# Altium project EIT.PrjPcb
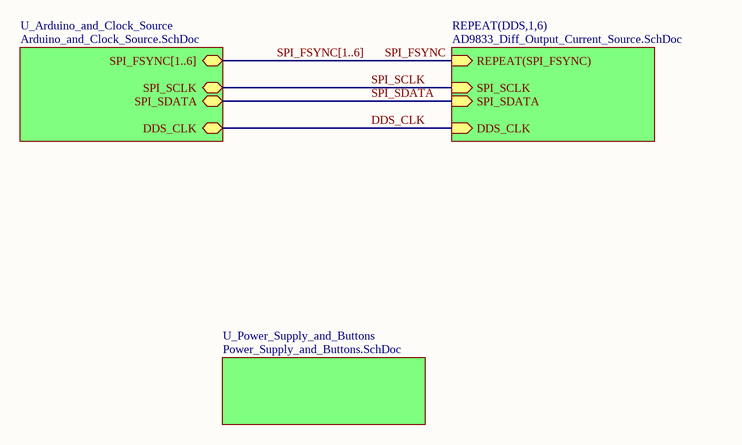
[diagram p0: Parallel_CS_Top.SchDoc]
4 sheets, 393 parts. Net scope: hierarchical (ports join the sheet entries above them; power ports are global).
Board file: Parallel_CS.PcbDoc
Sheets:
  Parallel_CS_Top.SchDoc
    DDS1 = AD9833_Diff_Output_Current_Source.SchDoc
    DDS2 = AD9833_Diff_Output_Current_Source.SchDoc
    DDS3 = AD9833_Diff_Output_Current_Source.SchDoc
    DDS4 = AD9833_Diff_Output_Current_Source.SchDoc
    DDS5 = AD9833_Diff_Output_Current_Source.SchDoc
    DDS6 = AD9833_Diff_Output_Current_Source.SchDoc
    U_Power_Supply_and_Buttons = Power_Supply_and_Buttons.SchDoc
    U_Arduino_and_Clock_Source = Arduino_and_Clock_Source.SchDoc

## Sheet Parallel_CS_Top.SchDoc
size A4

### Sub-sheets
REPEAT(DDS,1,6) = AD9833_Diff_Output_Current_Source.SchDoc: REPEAT(SPI_FSYNC) (in), SPI_SCLK (in), SPI_SDATA (in), DDS_CLK (in)
U_Arduino_and_Clock_Source = Arduino_and_Clock_Source.SchDoc: DDS_CLK (bidir), SPI_SDATA (bidir), SPI_SCLK (bidir), SPI_FSYNC[1..6] (bidir)
U_Power_Supply_and_Buttons = Power_Supply_and_Buttons.SchDoc: no entries

### Nets
DDS_CLK: sheet REPEAT(DDS,1,6)/DDS_CLK, sheet U_Arduino_and_Clock_Source/DDS_CLK
SPI_FSYNC: sheet REPEAT(DDS,1,6)/REPEAT(SPI_FSYNC)
SPI_SCLK: sheet REPEAT(DDS,1,6)/SPI_SCLK, sheet U_Arduino_and_Clock_Source/SPI_SCLK
SPI_SDATA: sheet REPEAT(DDS,1,6)/SPI_SDATA, sheet U_Arduino_and_Clock_Source/SPI_SDATA

### Buses and harness runs
bus SPI_FSYNC[1..6] = sheet U_Arduino_and_Clock_Source/SPI_FSYNC[1..6]

## Sheet AD9833_Diff_Output_Current_Source.SchDoc
size A3
Used 6 times, as channels DDS1, DDS2, DDS3, DDS4, DDS5, DDS6. Parts and nets are listed once, with the designators drawn on the sheet.
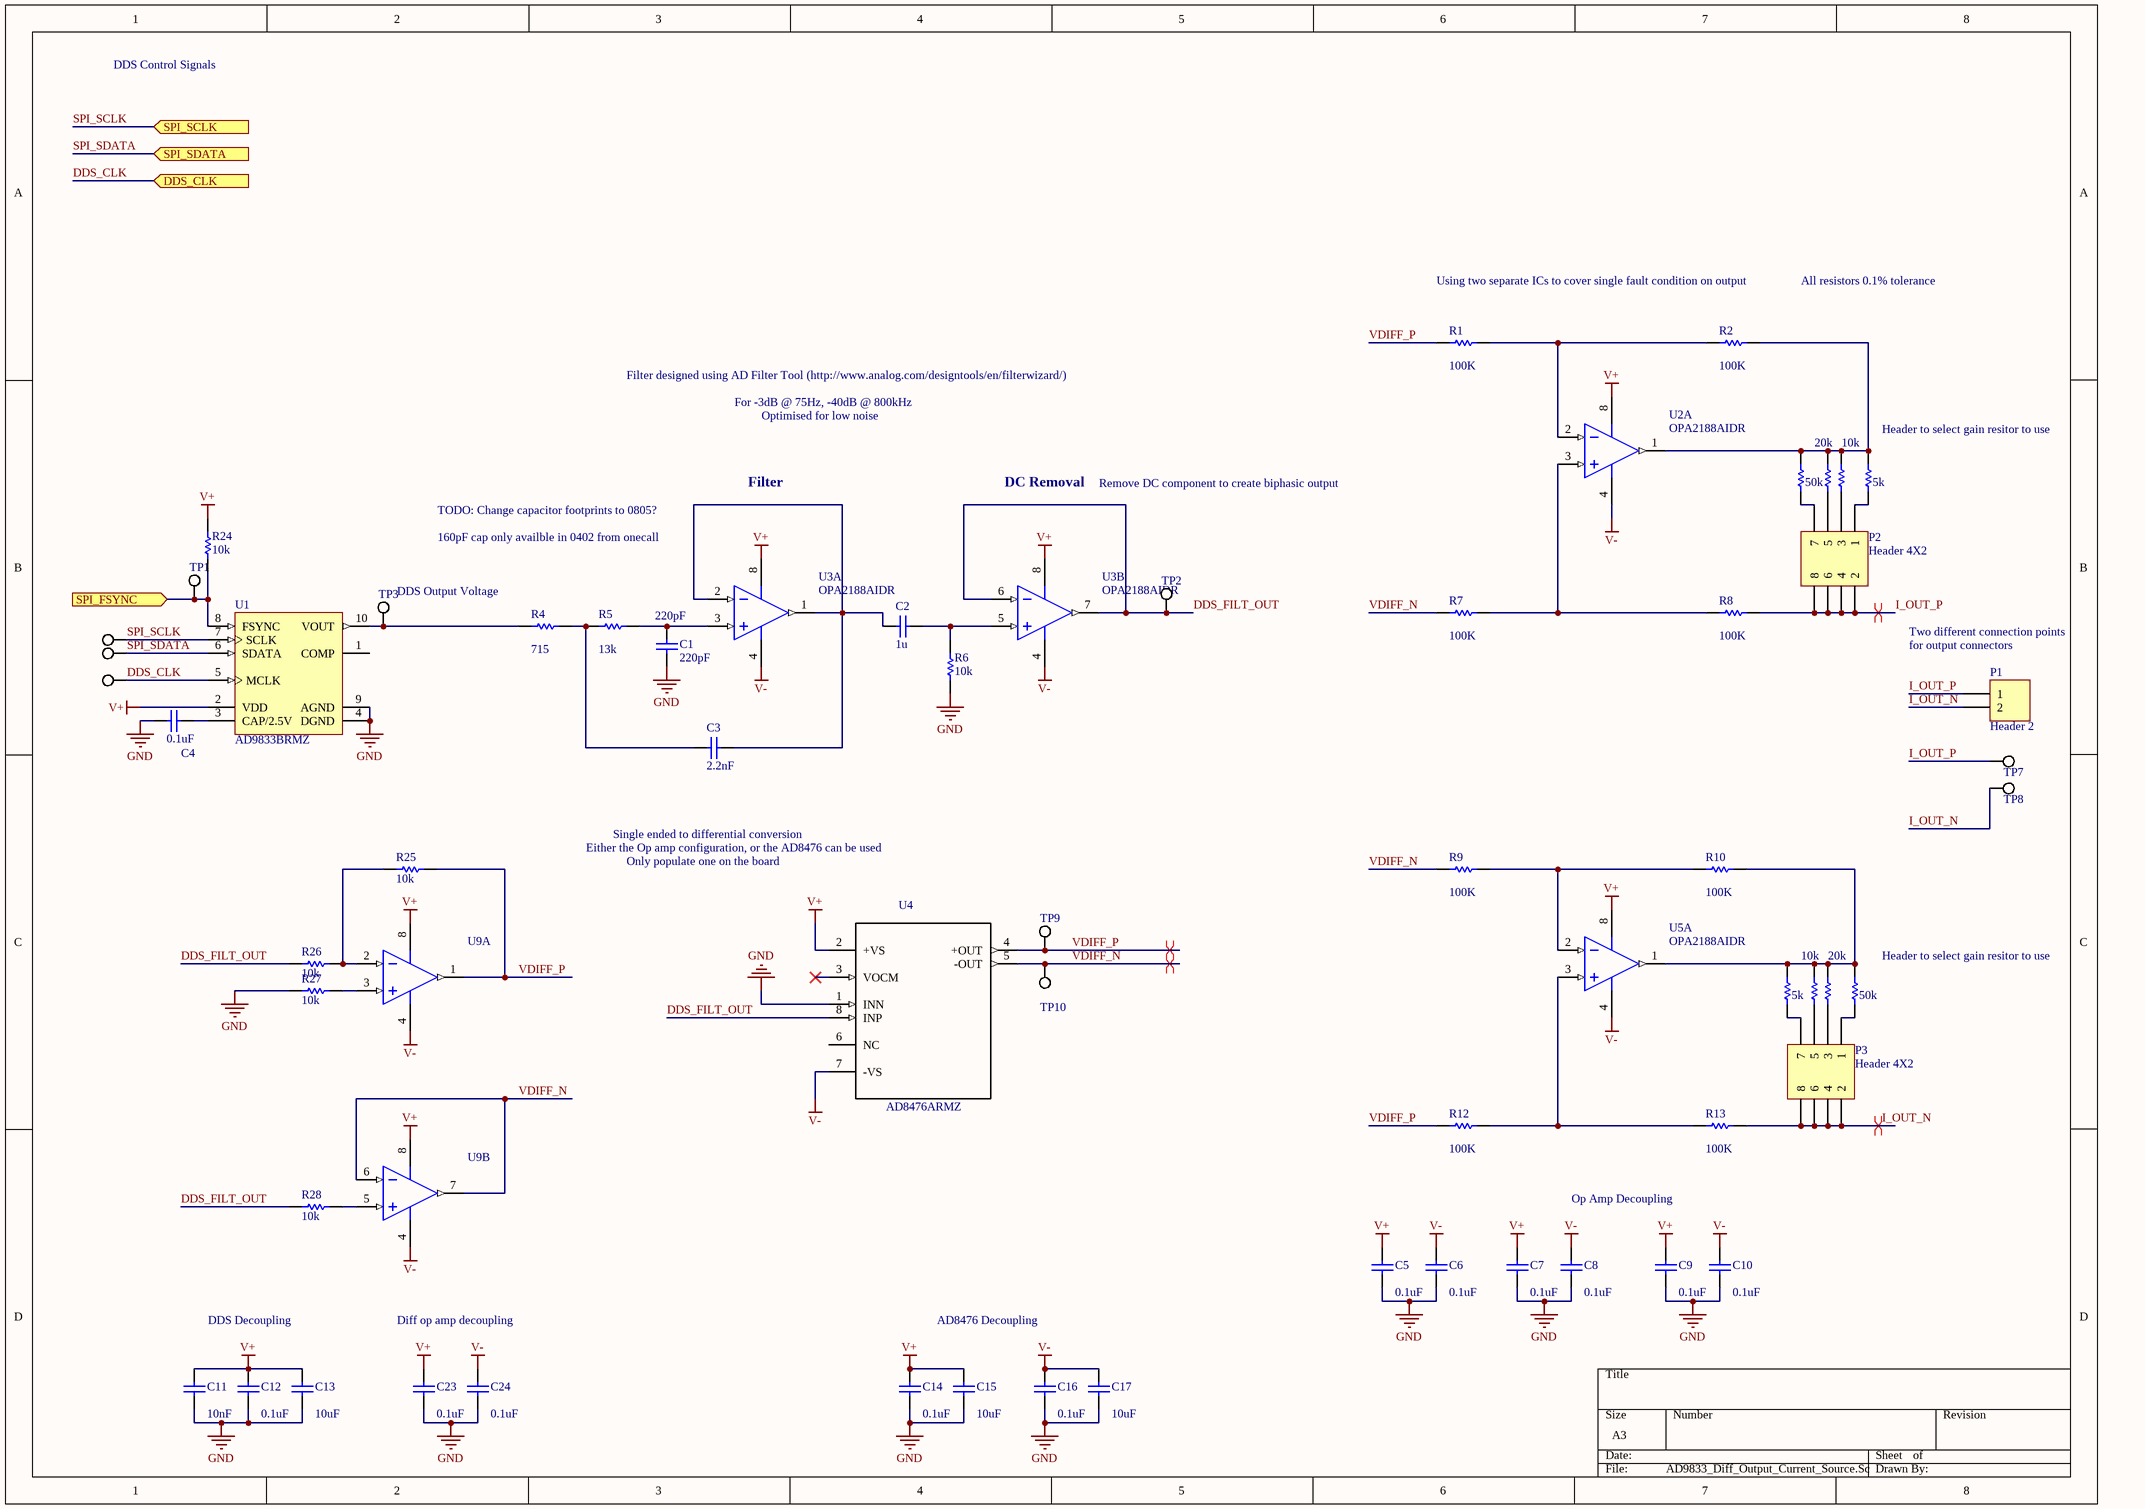
[diagram p1: AD9833_Diff_Output_Current_Source.SchDoc]

### Parts
C1  220pF  [1608[0603]]
C2  1u  [1608[0603]]
C3  2.2nF  [1608[0603]]
C4  0.1uF  [1608[0603]]
C5  0.1uF  [1608[0603]]
C6  0.1uF  [1608[0603]]
C7  0.1uF  [1608[0603]]
C8  0.1uF  [1608[0603]]
C9  0.1uF  [1608[0603]]
C10  0.1uF  [1608[0603]]
C11  10nF  [1608[0603]]
C12  0.1uF  [1608[0603]]
C13  10uF  [1608[0603]]
C14  0.1uF  [1608[0603]]
C15  10uF  [1608[0603]]
C16  0.1uF  [1608[0603]]
C17  10uF  [1608[0603]]
C23  0.1uF  [1608[0603]]
C24  0.1uF  [1608[0603]]
P1  Header 2  [HDR1X2]
P2  Header 4X2  [HDR2X4]
P3  Header 4X2  [HDR2X4]
R1  100K  [6-0805_M]
R2  100K  [6-0805_M]
R3  50k  [6-0805_M]
R4  715  [6-0805_M]
R5  13k  [6-0805_M]
R6  10k  [6-0805_M]
R7  100K  [6-0805_M]
R8  100K  [6-0805_M]
R9  100K  [6-0805_M]
R10  100K  [6-0805_M]
R11  20k  [6-0805_M]
R12  100K  [6-0805_M]
R13  100K  [6-0805_M]
R18  10k  [6-0805_M]
R19  5k  [6-0805_M]
R20  5k  [6-0805_M]
R21  10k  [6-0805_M]
R22  20k  [6-0805_M]
R23  50k  [6-0805_M]
R24  10k  [6-0805_M]
R25  10k  [6-0805_M]
R26  10k  [6-0805_M]
R27  10k  [6-0805_M]
R28  10k  [6-0805_M]
TP1  TESTPOINT_WHITE  [TestPointVia]  (value not drawn)
TP2  TESTPOINT_WHITE  [TestPointVia]  (value not drawn)
TP3  TESTPOINT_WHITE  [TestPointVia]  (value not drawn)
TP4  TESTPOINT_WHITE  [TestPointVia]  (value not drawn)
TP5  TESTPOINT_WHITE  [TestPointVia]  (value not drawn)
TP6  TESTPOINT_WHITE  [TestPointVia]  (value not drawn)
TP7  TESTPOINT_WHITE  [TestPointVia]  (value not drawn)
TP8  TESTPOINT_WHITE  [TestPointVia]  (value not drawn)
TP9  TESTPOINT_WHITE  [TestPointVia]  (value not drawn)
TP10  TESTPOINT_WHITE  [TestPointVia]  (value not drawn)
U1  AD9833BRMZ  [ADI-RM-10_M]
U2  OPA2188AIDR  [D0008A_L]  (part A of 2)
U3  OPA2188AIDR  [D0008A_L]  (parts A,B of 2)
U4  AD8476ARMZ  [SOP65P490X110-8N]
U5  OPA2188AIDR  [D0008A_L]  (part A of 2)
U9  OPA2188AIDR  [D0008A_L]  (value not drawn)  (parts A,B of 2)

### Ports
DDS_CLK (in), SPI_FSYNC (in), SPI_SCLK (in), SPI_SDATA (in)

### Nets
GND: C1.1 C4.1 C5.1 C6.1 C7.1 C8.1 C9.1 C10.1 C11.1 C12.1 C13.1 C14.1 C15.1 C16.1 C17.1 C23.1 C24.1 R6.1 R27.2 U1.4(DGND) U1.9(AGND) U4.1(INN)
V+: C5.2 C7.2 C9.2 C11.2 C12.2 C13.2 C14.2 C15.2 C23.2 R24.2 U1.2(VDD) U2.8(V+) U3.8(V+) U4.2(+VS) U5.8(V+) U9.8(V+)
V-: C6.2 C8.2 C10.2 C16.2 C17.2 C24.2 U2.4(V-) U3.4(V-) U4.7(-VS) U5.4(V-) U9.4(V-)
DDS_CLK: TP6.1 U1.5(MCLK) ; port DDS_CLK
DDS_FILT_OUT: R26.2 R28.2 TP2.1 U3.6(IN_B-) U3.7(OUT_B) U4.8(INP)
I_OUT_N: P1.2 P3.2 P3.4 P3.6 P3.8 R13.2 TP8.1
I_OUT_P: P1.1 P2.2 P2.4 P2.6 P2.8 R8.2 TP7.1
SPI_FSYNC: R24.1 TP1.1 U1.8(FSYNC) ; port SPI_FSYNC
SPI_SCLK: TP4.1 U1.7(SCLK) ; port SPI_SCLK
SPI_SDATA: TP5.1 U1.6(SDATA) ; port SPI_SDATA
VDIFF_N: R7.1 R9.1 TP10.1 U4.5(-OUT) U9.6(IN_B-) U9.7(OUT_B)
VDIFF_P: R1.1 R12.1 R25.1 TP9.1 U4.4(+OUT) U9.1(OUT_A)
NetC1_2: C1.2 R5.2 U3.3(IN_A+)
NetC2_1: C2.1 C3.1 U3.1(OUT_A) U3.2(IN_A-)
NetC2_2: C2.2 R6.2 U3.5(IN_B+)
NetC3_2: C3.2 R4.2 R5.1
NetC4_2: C4.2 U1.3(CAP/2.5V)
NetP2_1: P2.1 R19.2
NetP2_3: P2.3 R18.2
NetP2_5: P2.5 R11.2
NetP2_7: P2.7 R3.1
NetP3_1: P3.1 R23.1
NetP3_3: P3.3 R22.2
NetP3_5: P3.5 R21.2
NetP3_7: P3.7 R20.2
NetR1_2: R1.2 R2.1 U2.2(IN_A-)
NetR2_2: R2.2 R3.2 R11.1 R18.1 R19.1 U2.1(OUT_A)
NetR4_1: R4.1 TP3.1 U1.10(VOUT)
NetR7_2: R7.2 R8.1 U2.3(IN_A+)
NetR9_2: R9.2 R10.1 U5.2(IN_A-)
NetR10_2: R10.2 R20.1 R21.1 R22.1 R23.2 U5.1(OUT_A)
NetR12_2: R12.2 R13.1 U5.3(IN_A+)
NetR25_2: R25.2 R26.1 U9.2(IN_A-)
NetR27_1: R27.1 U9.3(IN_A+)
NetR28_1: R28.1 U9.5(IN_B+)

Not connected (* = marked no-connect by the designer): U1 1(COMP); U4 3(VOCM)* 6(NC)

### Channels
DDS1: designators C1=DDS1_C1 C2=DDS1_C2 C3=DDS1_C3 C4=DDS1_C4 C5=DDS1_C5 C6=DDS1_C6 C7=DDS1_C7 C8=DDS1_C8 C9=DDS1_C9 C10=DDS1_C10 C11=DDS1_C11 C12=DDS1_C12 C13=DDS1_C13 C14=DDS1_C14 C15=DDS1_C15 C16=DDS1_C16 C17=DDS1_C17 C23=DDS1_C23 C24=DDS1_C24 P1=DDS1_P1 P2=DDS1_P2 P3=DDS1_P3 R1=DDS1_R1 R2=DDS1_R2 R3=DDS1_R3 R4=DDS1_R4 R5=DDS1_R5 R6=DDS1_R6 R7=DDS1_R7 R8=DDS1_R8 R9=DDS1_R9 R10=DDS1_R10 R11=DDS1_R11 R12=DDS1_R12 R13=DDS1_R13 R18=DDS1_R18 R19=DDS1_R19 R20=DDS1_R20 R21=DDS1_R21 R22=DDS1_R22 R23=DDS1_R23 R24=DDS1_R24 R25=DDS1_R25 R26=DDS1_R26 R27=DDS1_R27 R28=DDS1_R28 TP1=DDS1_TP1 TP2=DDS1_TP2 TP3=DDS1_TP3 TP4=DDS1_TP4 TP5=DDS1_TP5 TP6=DDS1_TP6 TP7=DDS1_TP7 TP8=DDS1_TP8 TP9=DDS1_TP9 TP10=DDS1_TP10 U1=DDS1_U1 U2=DDS1_U2 U3=DDS1_U3 U4=DDS1_U4 U5=DDS1_U5 U9=DDS1_U9; ports DDS_CLK=DDS_CLK SPI_FSYNC=SPI_FSYNC1 SPI_SCLK=SPI_SCLK SPI_SDATA=SPI_SDATA
DDS2: designators C1=DDS2_C1 C2=DDS2_C2 C3=DDS2_C3 C4=DDS2_C4 C5=DDS2_C5 C6=DDS2_C6 C7=DDS2_C7 C8=DDS2_C8 C9=DDS2_C9 C10=DDS2_C10 C11=DDS2_C11 C12=DDS2_C12 C13=DDS2_C13 C14=DDS2_C14 C15=DDS2_C15 C16=DDS2_C16 C17=DDS2_C17 C23=DDS2_C23 C24=DDS2_C24 P1=DDS2_P1 P2=DDS2_P2 P3=DDS2_P3 R1=DDS2_R1 R2=DDS2_R2 R3=DDS2_R3 R4=DDS2_R4 R5=DDS2_R5 R6=DDS2_R6 R7=DDS2_R7 R8=DDS2_R8 R9=DDS2_R9 R10=DDS2_R10 R11=DDS2_R11 R12=DDS2_R12 R13=DDS2_R13 R18=DDS2_R18 R19=DDS2_R19 R20=DDS2_R20 R21=DDS2_R21 R22=DDS2_R22 R23=DDS2_R23 R24=DDS2_R24 R25=DDS2_R25 R26=DDS2_R26 R27=DDS2_R27 R28=DDS2_R28 TP1=DDS2_TP1 TP2=DDS2_TP2 TP3=DDS2_TP3 TP4=DDS2_TP4 TP5=DDS2_TP5 TP6=DDS2_TP6 TP7=DDS2_TP7 TP8=DDS2_TP8 TP9=DDS2_TP9 TP10=DDS2_TP10 U1=DDS2_U1 U2=DDS2_U2 U3=DDS2_U3 U4=DDS2_U4 U5=DDS2_U5 U9=DDS2_U9; ports DDS_CLK=DDS_CLK SPI_FSYNC=SPI_FSYNC2 SPI_SCLK=SPI_SCLK SPI_SDATA=SPI_SDATA
DDS3: designators C1=DDS3_C1 C2=DDS3_C2 C3=DDS3_C3 C4=DDS3_C4 C5=DDS3_C5 C6=DDS3_C6 C7=DDS3_C7 C8=DDS3_C8 C9=DDS3_C9 C10=DDS3_C10 C11=DDS3_C11 C12=DDS3_C12 C13=DDS3_C13 C14=DDS3_C14 C15=DDS3_C15 C16=DDS3_C16 C17=DDS3_C17 C23=DDS3_C23 C24=DDS3_C24 P1=DDS3_P1 P2=DDS3_P2 P3=DDS3_P3 R1=DDS3_R1 R2=DDS3_R2 R3=DDS3_R3 R4=DDS3_R4 R5=DDS3_R5 R6=DDS3_R6 R7=DDS3_R7 R8=DDS3_R8 R9=DDS3_R9 R10=DDS3_R10 R11=DDS3_R11 R12=DDS3_R12 R13=DDS3_R13 R18=DDS3_R18 R19=DDS3_R19 R20=DDS3_R20 R21=DDS3_R21 R22=DDS3_R22 R23=DDS3_R23 R24=DDS3_R24 R25=DDS3_R25 R26=DDS3_R26 R27=DDS3_R27 R28=DDS3_R28 TP1=DDS3_TP1 TP2=DDS3_TP2 TP3=DDS3_TP3 TP4=DDS3_TP4 TP5=DDS3_TP5 TP6=DDS3_TP6 TP7=DDS3_TP7 TP8=DDS3_TP8 TP9=DDS3_TP9 TP10=DDS3_TP10 U1=DDS3_U1 U2=DDS3_U2 U3=DDS3_U3 U4=DDS3_U4 U5=DDS3_U5 U9=DDS3_U9; ports DDS_CLK=DDS_CLK SPI_FSYNC=SPI_FSYNC3 SPI_SCLK=SPI_SCLK SPI_SDATA=SPI_SDATA
DDS4: designators C1=DDS4_C1 C2=DDS4_C2 C3=DDS4_C3 C4=DDS4_C4 C5=DDS4_C5 C6=DDS4_C6 C7=DDS4_C7 C8=DDS4_C8 C9=DDS4_C9 C10=DDS4_C10 C11=DDS4_C11 C12=DDS4_C12 C13=DDS4_C13 C14=DDS4_C14 C15=DDS4_C15 C16=DDS4_C16 C17=DDS4_C17 C23=DDS4_C23 C24=DDS4_C24 P1=DDS4_P1 P2=DDS4_P2 P3=DDS4_P3 R1=DDS4_R1 R2=DDS4_R2 R3=DDS4_R3 R4=DDS4_R4 R5=DDS4_R5 R6=DDS4_R6 R7=DDS4_R7 R8=DDS4_R8 R9=DDS4_R9 R10=DDS4_R10 R11=DDS4_R11 R12=DDS4_R12 R13=DDS4_R13 R18=DDS4_R18 R19=DDS4_R19 R20=DDS4_R20 R21=DDS4_R21 R22=DDS4_R22 R23=DDS4_R23 R24=DDS4_R24 R25=DDS4_R25 R26=DDS4_R26 R27=DDS4_R27 R28=DDS4_R28 TP1=DDS4_TP1 TP2=DDS4_TP2 TP3=DDS4_TP3 TP4=DDS4_TP4 TP5=DDS4_TP5 TP6=DDS4_TP6 TP7=DDS4_TP7 TP8=DDS4_TP8 TP9=DDS4_TP9 TP10=DDS4_TP10 U1=DDS4_U1 U2=DDS4_U2 U3=DDS4_U3 U4=DDS4_U4 U5=DDS4_U5 U9=DDS4_U9; ports DDS_CLK=DDS_CLK SPI_FSYNC=SPI_FSYNC4 SPI_SCLK=SPI_SCLK SPI_SDATA=SPI_SDATA
DDS5: designators C1=DDS5_C1 C2=DDS5_C2 C3=DDS5_C3 C4=DDS5_C4 C5=DDS5_C5 C6=DDS5_C6 C7=DDS5_C7 C8=DDS5_C8 C9=DDS5_C9 C10=DDS5_C10 C11=DDS5_C11 C12=DDS5_C12 C13=DDS5_C13 C14=DDS5_C14 C15=DDS5_C15 C16=DDS5_C16 C17=DDS5_C17 C23=DDS5_C23 C24=DDS5_C24 P1=DDS5_P1 P2=DDS5_P2 P3=DDS5_P3 R1=DDS5_R1 R2=DDS5_R2 R3=DDS5_R3 R4=DDS5_R4 R5=DDS5_R5 R6=DDS5_R6 R7=DDS5_R7 R8=DDS5_R8 R9=DDS5_R9 R10=DDS5_R10 R11=DDS5_R11 R12=DDS5_R12 R13=DDS5_R13 R18=DDS5_R18 R19=DDS5_R19 R20=DDS5_R20 R21=DDS5_R21 R22=DDS5_R22 R23=DDS5_R23 R24=DDS5_R24 R25=DDS5_R25 R26=DDS5_R26 R27=DDS5_R27 R28=DDS5_R28 TP1=DDS5_TP1 TP2=DDS5_TP2 TP3=DDS5_TP3 TP4=DDS5_TP4 TP5=DDS5_TP5 TP6=DDS5_TP6 TP7=DDS5_TP7 TP8=DDS5_TP8 TP9=DDS5_TP9 TP10=DDS5_TP10 U1=DDS5_U1 U2=DDS5_U2 U3=DDS5_U3 U4=DDS5_U4 U5=DDS5_U5 U9=DDS5_U9; ports DDS_CLK=DDS_CLK SPI_FSYNC=SPI_FSYNC5 SPI_SCLK=SPI_SCLK SPI_SDATA=SPI_SDATA
DDS6: designators C1=DDS6_C1 C2=DDS6_C2 C3=DDS6_C3 C4=DDS6_C4 C5=DDS6_C5 C6=DDS6_C6 C7=DDS6_C7 C8=DDS6_C8 C9=DDS6_C9 C10=DDS6_C10 C11=DDS6_C11 C12=DDS6_C12 C13=DDS6_C13 C14=DDS6_C14 C15=DDS6_C15 C16=DDS6_C16 C17=DDS6_C17 C23=DDS6_C23 C24=DDS6_C24 P1=DDS6_P1 P2=DDS6_P2 P3=DDS6_P3 R1=DDS6_R1 R2=DDS6_R2 R3=DDS6_R3 R4=DDS6_R4 R5=DDS6_R5 R6=DDS6_R6 R7=DDS6_R7 R8=DDS6_R8 R9=DDS6_R9 R10=DDS6_R10 R11=DDS6_R11 R12=DDS6_R12 R13=DDS6_R13 R18=DDS6_R18 R19=DDS6_R19 R20=DDS6_R20 R21=DDS6_R21 R22=DDS6_R22 R23=DDS6_R23 R24=DDS6_R24 R25=DDS6_R25 R26=DDS6_R26 R27=DDS6_R27 R28=DDS6_R28 TP1=DDS6_TP1 TP2=DDS6_TP2 TP3=DDS6_TP3 TP4=DDS6_TP4 TP5=DDS6_TP5 TP6=DDS6_TP6 TP7=DDS6_TP7 TP8=DDS6_TP8 TP9=DDS6_TP9 TP10=DDS6_TP10 U1=DDS6_U1 U2=DDS6_U2 U3=DDS6_U3 U4=DDS6_U4 U5=DDS6_U5 U9=DDS6_U9; ports DDS_CLK=DDS_CLK SPI_FSYNC=SPI_FSYNC6 SPI_SCLK=SPI_SCLK SPI_SDATA=SPI_SDATA

### Layout directives
differential pair: I_OUT_N_DDS1, I_OUT_P_DDS1, VDIFF_N_DDS1, VDIFF_P_DDS1

### Notes on the sheet
- DDS Control Signals
- Using two separate ICs to cover single fault condition on output
- All resistors 0.1% tolerance
- Filter designed using AD Filter Tool (http://www.analog.com/designtools/en/filterwizard/)
- For -3dB @ 75Hz, -40dB @ 800kHz
- Optimised for low noise
- Header to select gain resitor to use
- TODO: Change capacitor footprints to 0805?
- Filter
- DC Removal
- Remove DC component to create biphasic output
- (near U3) 160pF cap only availble in 0402 from onecall
- (near TP3) DDS Output Voltage
- Two different connection points
- (near P1) for output connectors
- Either the Op amp configuration, or the AD8476 can be used
- Single ended to differential conversion
- Only populate one on the board
- (near R23) Header to select gain resitor to use
- Op Amp Decoupling
- DDS Decoupling
- Diff op amp decoupling
- AD8476 Decoupling

### Library data of the parts
C1-C17 C23 C24 = Cap Semi: Capacitor (Semiconductor SIM Model); Published: 8-Jun-2000; LatestRevisionDate: 29-May-2009; LatestRevisionNote: IPC-7351 Footprint Added.; PackageReference: C1206; Publisher: Altium Limited; PackageDescription: Chip Capacitor
  C1: Value: 220pF
  C2: Value: 1u
  C3: Value: 2.2nF
  C4-C10 C12 C14 C16 C23 C24: Value: 0.1uF
  C11: Value: 10nF
  C13 C15 C17: Value: 10uF
P1 = Header 2: Header, 2-Pin; LatestRevisionDate: 17-Jul-2002; LatestRevisionNote: Re-released for DXP Platform.; Publisher: Altium Limited
P2 P3 = Header 4X2: Header, 4-Pin, Dual row; LatestRevisionDate: 17-Jul-2002; LatestRevisionNote: Re-released for DXP Platform.; Publisher: Altium Limited
R1-R13 R18-R28 = Res1: Resistor; Published: 8-Jun-2000; LatestRevisionDate: 17-Jul-2002; LatestRevisionNote: Re-released for DXP Platform.; PackageReference: AXIAL-0.3; Publisher: Altium Limited; PackageDescription: Axial Device, Thru-Hole; 2 Leads; 0.3 in Pin Spacing
  R1 R2 R7-R10 R12 R13: Value: 100K
  R3 R23: Value: 50k
  R4: Value: 715
  R5: Value: 13k
  R6 R18 R21 R24-R28: Value: 10k
  R11 R22: Value: 20k
  R19 R20: Value: 5k
U1 = CMP-0293-00077-1: Low Power, 12.65 mW, 2.3 V to 5.5 V, Programmable Waveform Generator, 10-Bit, Serial, RM-10, 50 Tube, Pb-Free; Resolution (Bits): 10bit; Compliance Range (V): 650mV; FS Iout (mA nom): 3mA; REFCLK Multiplier: No; Master fclk: 25MHz; I Supply total (max): 5.5mA; Tuning Word Width (bits): 28bit; Code_JEDEC: MO-187-BA; DatasheetVersion: Rev. D; PackageVersion: 5/8/2005; ComponentLink1URL: www.analog.com; ComponentLink3Description: Package Specification; PackageDescription: 10-Lead Mini Small Outline Package [MSOP]; I/O Interface: Serial; ComponentLink2Description: Datasheet; ComponentLink1Description: Manufacturer URL; PackageReference: RM-10; ComponentLink2URL: http://www.analog.com/static/imported-files/data_sheets/AD9833.pdf; ComponentLink3URL: http://www.analog.com/static/imported-files/packages/PKG_PDF/MSOP%28RM%29/RM_10.pdf
U2 U3 U5 U9 = CMP-0272-00241-3: 0.03 uV/degC, 6 uV Vos, Low Noise, Rail-to-Rail Output, Zero-Drift Operational Amplifier, 4 to 36 V, -40 to 105 degC, 8-pin SOIC (D8), Green (RoHS & no Sb/Br); Manufacturer: Texas Instruments; Rating: Catalog; Number of Channels: 2; CMRR(Min)(dB): 120; Total Supply Voltage(Max)(+5V is 5, +/-5V is 10): 36; Packing: LARGE T&R; Slew Rate(Typ)(V/us): 0.8; Iq per channel(Max)(mA): 0.475; Vio (25C)(Max)(mV): 0.025; IIB(Max)(pA): 850; Offset Drift(Typ)(uV/C): 0.03; Sub Family: High Supply Voltage Amplifier (>=30V), Low Noise Amp (<=10nV/rtHz), Low Offset Voltage Amplifier (<=500uV), Low Power Amp (<=500uA), Precision Amplifier, Zero Drift Precision Amplifier; Total Supply Voltage(Min)(+5V is 5, +/-5V is 10): 4; Mounting Technology: Surface Mount; Code_JEDEC: MS-012; ComponentLink2Description: Datasheet; DatasheetVersion: SBOS525B; ComponentLink1URL: http://www.ti.com/; GBW(Typ)(MHz): 2; Eco-Plan: Green (RoHS & no Sb/Br); PackageVersion: 4040047-3/M, 06/2011; ComponentLink3Description: Package Specification; ComponentLink1Description: Manufacturer URL; PartNumber: OPA2188AIDR; ComponentLink2URL: http://www.ti.com/lit/ds/symlink/opa2188.pdf; ComponentLink3URL: http://www.ti.com/litv/pdf/msoi002j; PackageReference: D0008A; PackageDescription: 8-Pin Plastic Small Outline, Body 4.9 x 3.9 mm, Pitch 1.27 mm; PartId: 1
U4 = AD8476ARMZ: SP Amp DIFF AMP Single R-R O/P Â±9V/18V 8-Pin MSOP Tube; MF: Analog Devices; Price: 4.14 USD; Package: MSOP-8 Analog Devices; MP: AD8476ARMZ; Availability: Good; Value: *

## Sheet Power_Supply_and_Buttons.SchDoc
size A4
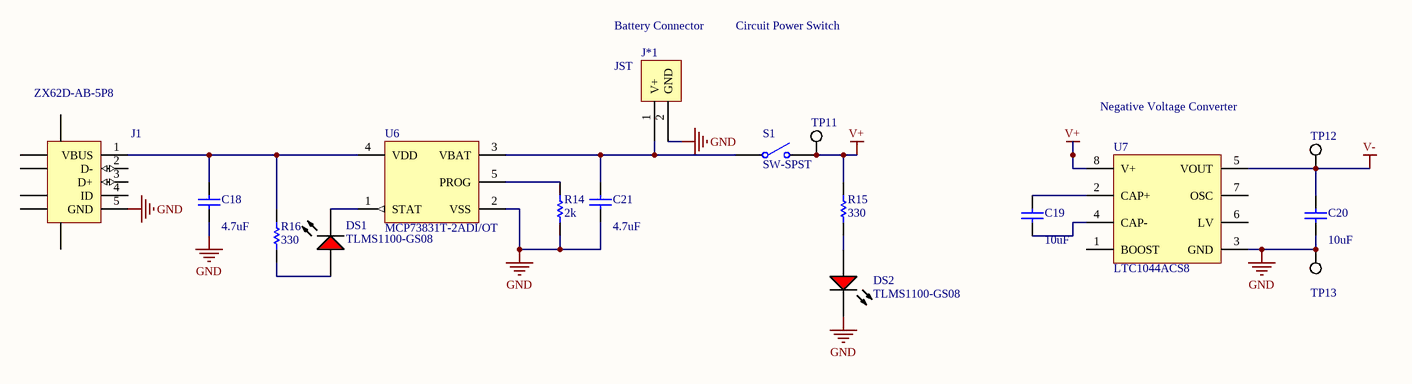
[diagram p2: Power_Supply_and_Buttons.SchDoc]

### Parts
C18  4.7uF  [1608[0603]]
C19  10uF  [1608[0603]]
C20  10uF  [1608[0603]]
C21  4.7uF  [1608[0603]]
DS1  TLMS1100-GS08  [VISH-TLMX1100_V]
DS2  TLMS1100-GS08  [VISH-TLMX1100_V]
J1  ZX62D-AB-5P8  [HIRO-ZX62D-AB-5P8_V]
J*1  JST  [JST- S2B-PH-SM4-TB(LF)(SN)-2_V]
R14  2k  [6-0805_M]
R15  330  [6-0805_M]
R16  330  [6-0805_M]
S1  SW-SPST  [SPST-2]
TP11  TESTPOINT_WHITE  [TestPointVia]  (value not drawn)
TP12  TESTPOINT_WHITE  [TestPointVia]  (value not drawn)
TP13  TESTPOINT_WHITE  [TestPointVia]  (value not drawn)
U6  MCP73831T-2ADI/OT  [SOT-23-OT5_M]
U7  LTC1044ACS8  [LT-S8-8_M]

### Nets
GND: C18.1 C20.1 C21.1 DS2.2(K) J1.5(GND) J*1.2(GND) R14.1 TP13.1 U6.2(VSS) U7.3(GND)
V+: R15.2 S1.2(NO) TP11.1 U7.8(V+)
V-: C20.2 TP12.1 U7.5(VOUT)
NetC18_2: C18.2 J1.1(VBUS) R16.2 U6.4(VDD)
NetC19_1: C19.1 U7.4(CAP-)
NetC19_2: C19.2 U7.2(CAP+)
NetC21_2: C21.2 J*1.1(V+) S1.1(COMMON) U6.3(VBAT)
NetDS1_1: DS1.1(A) R16.1
NetDS1_2: DS1.2(K) U6.1(STAT)
NetDS2_1: DS2.1(A) R15.1
NetR14_2: R14.2 U6.5(PROG)

Not connected (* = marked no-connect by the designer): J1 2(D-) 3(D+) 4(ID) 6(SHLD) 7(SHLD) 8(SHLD) 9(SHLD) 10(SHLD) 11(SHLD); U7 1(BOOST) 6(LV) 7(OSC)

### Notes on the sheet
- Battery Connector
- Circuit Power Switch
- Negative Voltage Converter

### Library data of the parts
C18-C21 = Cap Semi: Capacitor (Semiconductor SIM Model); Published: 8-Jun-2000; LatestRevisionDate: 29-May-2009; LatestRevisionNote: IPC-7351 Footprint Added.; PackageReference: C1206; Publisher: Altium Limited; PackageDescription: Chip Capacitor
  C18 C21: Value: 4.7uF
  C19 C20: Value: 10uF
DS1 DS2 = CMP-1666-00027-1: LED, RED, 2.1 V, -40 to 100 degC, 2-Pin SMD (0603), RoHS, Tape and Reel; Type (Capacitors): C0G; Resistance: 100000000000 Ohm; Capacitance: 12 pF; Voltage Rating: 50 V; Tolerance: 5%; Min Operating Temperature: -55degC; REACH SVHC: No SVHC; ComponentLink2Description: Datasheet; ComponentLink1URL: http://www.vishay.com/; Width: 0.8 mm; Package Quantity: 4000; PackageReference: TLMX1100; ComponentLink2URL: http://www.vishay.com/docs/83173/tlmb1100.pdf; Case/Package: 0603; Case Code (Metric): 1608; Packaging: Tape and Reel; Pins: 2; ComponentLink1Description: Manufacturer URL; Max Operating Temperature: 125degC; Height: 0.8 mm; Length: 1.6 mm; Mount: Surface Mount; PackageDescription: 2-Pin Surface Mount Device, Body 1.6 x 0.8 mm; DatasheetVersion: Rev. 2.7, 03/2016; Case Code (Imperial): 0603; Voltage Rating (DC): 50 V; RoHSCompliant: True; Radiation Hardening: No
J1 = CMP-1349-00001-2: USB 2.0 Standard Micro-USB Connector, Micro AB-Standard (Bottom Mount), 30 V AC, -30 to 85 degC, Right Angle, 5-Pin 7.5 x 5.6 x 2.8 mm SMD, RoHS, Reel; Manufacturer: Hirose Electric; Number of Contacts: 5; Capacitance: 2 pF Max.; Voltage Rating: 30 V AC; Contact Resistance: 30 mOhm Max.; PartNumber: ZX62D-AB-5P8; Mounting Technology: Surface Mount; ComponentLink1URL: http://www.hirose.com/; ComponentLink2URL: http://www.hirose.co.jp/cataloge_hp/ed_ZX_20140804.pdf; ComponentLink1Description: Manufacturer URL; ComponentLink3Description: Package Specification; Operating Temperature Range: -30 to 85 degC; RoHS: TRUE; DatasheetVersion: Aug-14; PackageDescription: USB Micro-AB Connector, Right Angle, Body 7.5 x 5.6 mm, Pitch 0.65 mm, Height 2.8 mm; ComponentLink3URL: http://www.hirose.co.jp/cataloge_hp/ed_ZX_20140804.pdf; Packing: Reel; ComponentLink2Description: Datasheet
R14-R16 = Res1: Resistor; Published: 8-Jun-2000; LatestRevisionDate: 17-Jul-2002; LatestRevisionNote: Re-released for DXP Platform.; PackageReference: AXIAL-0.3; Publisher: Altium Limited; PackageDescription: Axial Device, Thru-Hole; 2 Leads; 0.3 in Pin Spacing
  R14: Value: 2k
  R15 R16: Value: 330
S1 = SW-SPST: Single-Pole, Single-Throw Switch; Published: 24-Mar-1999; LatestRevisionDate: 17-Jul-2002; LatestRevisionNote: Re-released for DXP Platform.; PackageReference: SPST-2; Publisher: Altium Limited; PackageDescription: Switch; 2 Leads
U6 = CMP-0133-00142-1: Miniature Single-Cell, Fully Integrated Li-Ion, Li-Polymer Charge Management Controller, 4.2V, 5-Pin SOT-23, Industrial Temperature, Tape and Reel; PackageVersion: revBB, Aug-2009; DatasheetVersion: revE, Sep-2008; PackageDescription: 5-Lead Plastic Small Outline Transistor (OT) [SOT-23]; PackageReference: SOT-23-OT5; Code_IPC: SOT23-5
U7 = CMP-0475-00491-1: 12 V CMOS Voltage Converter, 8-pin SOIC (S8-8), 0 to 70 degC; Manufacturer: Linear Technology; Isupply(mA): 0.2; Voutput: 2Vin, -Vin, 0.5Vin; Vin Max(V): 12; Frequency(kHz): 5; Max Iout(mA): 20; Vin Min(V): 1.5; ComponentLink1Description: Manufacturer URL; PartNumber: LTC1044ACS8; PackageVersion: Rev. G, 03/2012; ComponentLink2URL: http://cds.linear.com/docs/en/datasheet/lt1044a.pdf; PackageReference: S8-8; ComponentLink2Description: Datasheet; DatasheetVersion: Rev. 0; RoHS: FALSE; PackageDescription: 8-Pin Plastic Small Outline (Narrow .150 Inch), Body 4.9 x 3.9 mm, Pitch 1.27 mm; ComponentLink3Description: Package Specification; Mounting Technology: Surface Mount; ComponentLink3URL: http://cds.linear.com/docs/en/packaging/05081610_G_SO8.pdf; ComponentLink1URL: http://www.linear.com/

## Sheet Arduino_and_Clock_Source.SchDoc
size A4
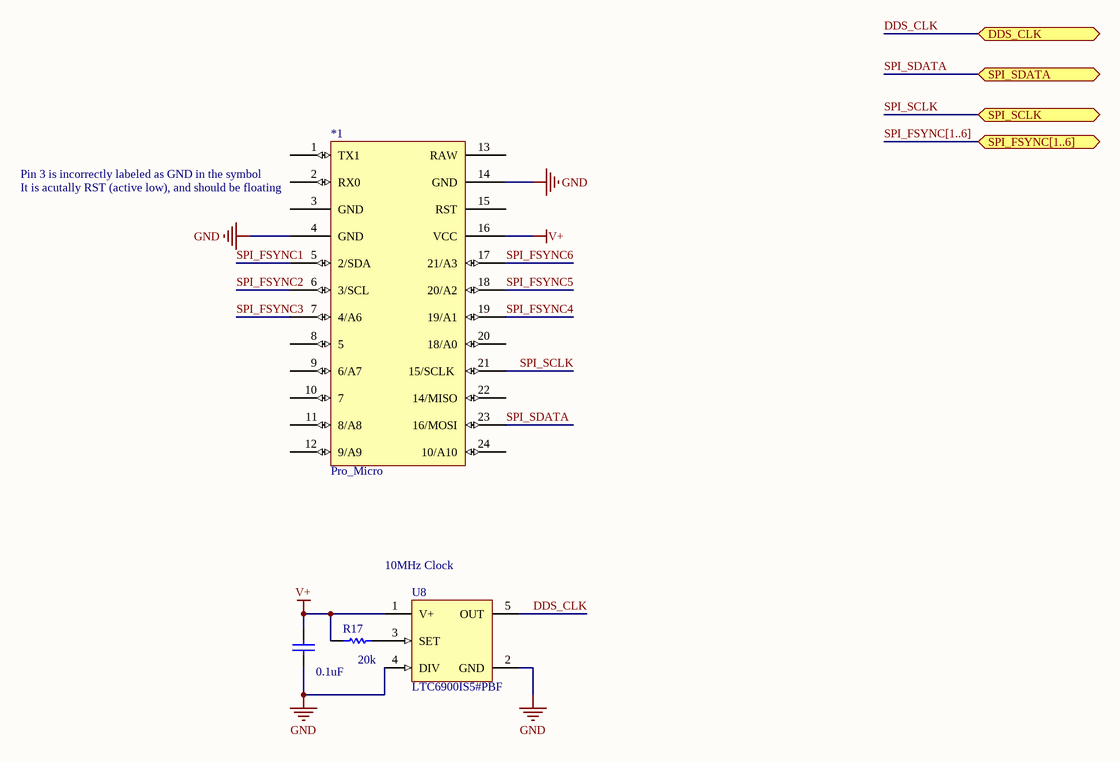
[diagram p3: Arduino_and_Clock_Source.SchDoc]

### Parts
*1  Pro_Micro  [Pro_Micro]
C22  0.1uF  [1608[0603]]
R17  20k  [6-0805_M]
U8  LTC6900IS5#PBF  [LT-TSOT-23-5_V]

### Ports
DDS_CLK (bidir), SPI_FSYNC[1..6] (bidir), SPI_SCLK (bidir), SPI_SDATA (bidir)

### Nets
GND: *1.4(GND) *1.14(GND) C22.1 U8.2(GND) U8.4(DIV)
V+: *1.16(VCC) C22.2 R17.1 U8.1(V+)
DDS_CLK: U8.5(OUT) ; port DDS_CLK
SPI_FSYNC1: *1.5(2/SDA)
SPI_FSYNC2: *1.6(3/SCL)
SPI_FSYNC3: *1.7(4/A6)
SPI_FSYNC4: *1.19(19/A1)
SPI_FSYNC5: *1.18(20/A2)
SPI_FSYNC6: *1.17(21/A3)
SPI_SCLK: *1.21(15/SCLK) ; port SPI_SCLK
SPI_SDATA: *1.23(16/MOSI) ; port SPI_SDATA
NetR17_2: R17.2 U8.3(SET)

Not connected (* = marked no-connect by the designer): *1 1(TX1) 2(RX0) 3(GND) 8(5) 9(6/A7) 10(7) 11(8/A8) 12(9/A9) 13(RAW) 15(RST) 20(18/A0) 22(14/MISO) 24(10/A10)

### Buses and harness runs
bus SPI_FSYNC[1..6] = port SPI_FSYNC[1..6]

### Notes on the sheet
- (near *1) Pin 3 is incorrectly labeled as GND in the symbol
- (near *1) It is acutally RST (active low), and should be floating
- (near U8) 10MHz Clock

### Library data of the parts
C22 = Cap Semi: Capacitor (Semiconductor SIM Model); Published: 8-Jun-2000; LatestRevisionDate: 29-May-2009; LatestRevisionNote: IPC-7351 Footprint Added.; PackageReference: C1206; Publisher: Altium Limited; PackageDescription: Chip Capacitor; Value: 0.1uF
R17 = Res1: Resistor; Published: 8-Jun-2000; LatestRevisionDate: 17-Jul-2002; LatestRevisionNote: Re-released for DXP Platform.; PackageReference: AXIAL-0.3; Publisher: Altium Limited; PackageDescription: Axial Device, Thru-Hole; 2 Leads; 0.3 in Pin Spacing; Value: 20k
U8 = CMP-2000-06612-1: Low Power, Resistor Set Oscillator, 1 KHz to 20 MHz, 2.7 to 5.5 V, -40 to 85 degC, 5-Pin SOT-23 (S5), Pb-Free; Manufacturer: Linear Technology; Frequency: 20MHz; Supply Voltage Range: 2.7Vto5.5V; Supply Voltage Min: 2.7V; Supply Voltage Max: 5.5V; Base Number: 6900; SVHC: NoSVHC(19-Dec-2012); No. of Pins: 5; Clock External Input: No; Operating Temperature Min: -40°C; Operating Temperature Range: -40°Cto+85°C; Manufacturer URL: http://www.linear.com/; Operating Frequency Max: 20MHz; Package Description: 5-Pin Small Outline Transistor, Body 2.9 x 1.625 mm, Pitch 0.95 mm; Operating Temperature Max: 85°C; MSL: MSL1-Unlimited; Datasheet Version: Rev. A, 07/2009; Package / Case: SOT-23; Datasheet URL: http://cds.linear.com/docs/en/datasheet/6900fa.pdf; Termination Type: SMD; Package Reference: TSOT23-5; Mounting Technology: SurfaceMount; Digital IC Case Style: SOT-23

## Nets that join several sheets
GND: DDS1 (22 pins), DDS2 (22 pins), DDS3 (22 pins), DDS4 (22 pins), DDS5 (22 pins), DDS6 (22 pins), Power_Supply_and_Buttons (10 pins), Arduino_and_Clock_Source (5 pins)
V+: DDS1 (16 pins), DDS2 (16 pins), DDS3 (16 pins), DDS4 (16 pins), DDS5 (16 pins), DDS6 (16 pins), Power_Supply_and_Buttons (R15.2 S1.2 TP11.1 U7.8), Arduino_and_Clock_Source (*1.16 C22.2 R17.1 U8.1)
V-: DDS1 (11 pins), DDS2 (11 pins), DDS3 (11 pins), DDS4 (11 pins), DDS5 (11 pins), DDS6 (11 pins), Power_Supply_and_Buttons (C20.2 TP12.1 U7.5)
DDS_CLK: DDS1 (DDS1_TP6.1 DDS1_U1.5), DDS2 (DDS2_TP6.1 DDS2_U1.5), DDS3 (DDS3_TP6.1 DDS3_U1.5), DDS4 (DDS4_TP6.1 DDS4_U1.5), DDS5 (DDS5_TP6.1 DDS5_U1.5), DDS6 (DDS6_TP6.1 DDS6_U1.5), Arduino_and_Clock_Source (U8.5)
SPI_FSYNC1: DDS1 (DDS1_R24.1 DDS1_TP1.1 DDS1_U1.8), Arduino_and_Clock_Source (*1.5)
SPI_FSYNC2: DDS2 (DDS2_R24.1 DDS2_TP1.1 DDS2_U1.8), Arduino_and_Clock_Source (*1.6)
SPI_FSYNC3: DDS3 (DDS3_R24.1 DDS3_TP1.1 DDS3_U1.8), Arduino_and_Clock_Source (*1.7)
SPI_FSYNC4: DDS4 (DDS4_R24.1 DDS4_TP1.1 DDS4_U1.8), Arduino_and_Clock_Source (*1.19)
SPI_FSYNC5: DDS5 (DDS5_R24.1 DDS5_TP1.1 DDS5_U1.8), Arduino_and_Clock_Source (*1.18)
SPI_FSYNC6: DDS6 (DDS6_R24.1 DDS6_TP1.1 DDS6_U1.8), Arduino_and_Clock_Source (*1.17)
SPI_SCLK: DDS1 (DDS1_TP4.1 DDS1_U1.7), DDS2 (DDS2_TP4.1 DDS2_U1.7), DDS3 (DDS3_TP4.1 DDS3_U1.7), DDS4 (DDS4_TP4.1 DDS4_U1.7), DDS5 (DDS5_TP4.1 DDS5_U1.7), DDS6 (DDS6_TP4.1 DDS6_U1.7), Arduino_and_Clock_Source (*1.21)
SPI_SDATA: DDS1 (DDS1_TP5.1 DDS1_U1.6), DDS2 (DDS2_TP5.1 DDS2_U1.6), DDS3 (DDS3_TP5.1 DDS3_U1.6), DDS4 (DDS4_TP5.1 DDS4_U1.6), DDS5 (DDS5_TP5.1 DDS5_U1.6), DDS6 (DDS6_TP5.1 DDS6_U1.6), Arduino_and_Clock_Source (*1.23)